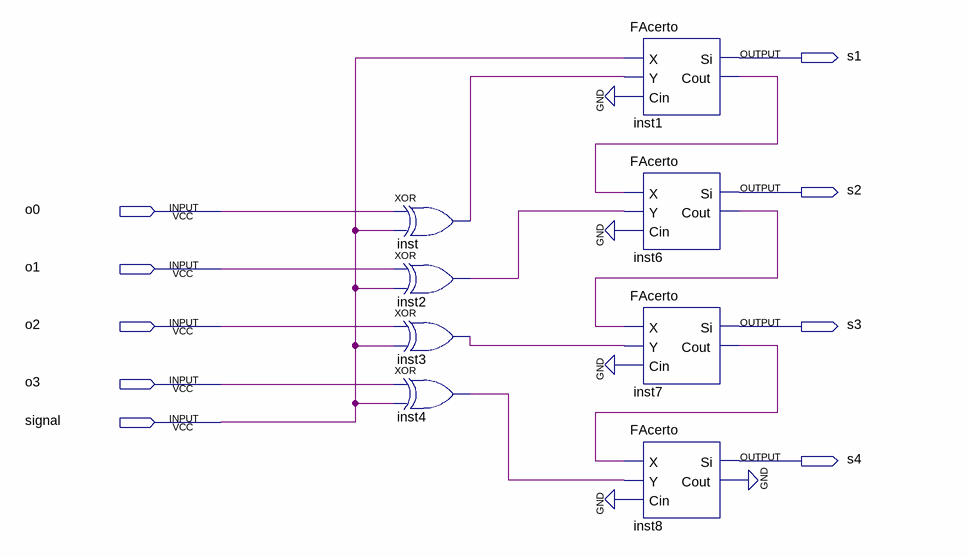
[diagram p0: schematic sheet]
// Quartus schematic comp2.bdf as structural Verilog: 8 symbols, 9 pins
module comp2 (
  input  o0,
  input  o1,
  input  o2,
  input  o3,
  input  signal,
  output s1,
  output s2,
  output s3,
  output s4
);

  wire inst1_cout, inst2_out, inst3_out, inst4_out, inst6_cout, inst7_cout, inst8_cout, inst_out;

  xor inst (inst_out, o0, signal);
  xor inst2 (inst2_out, o1, signal);
  xor inst3 (inst3_out, o2, signal);
  xor inst4 (inst4_out, o3, signal);
  FAcerto inst1 (.X(signal), .Y(inst_out), .Cin(1'b0), .Si(s1), .Cout(inst1_cout));
  FAcerto inst6 (.X(inst1_cout), .Y(inst2_out), .Cin(1'b0), .Si(s2), .Cout(inst6_cout));
  FAcerto inst7 (.X(inst6_cout), .Y(inst3_out), .Cin(1'b0), .Si(s3), .Cout(inst7_cout));
  FAcerto inst8 (.X(inst7_cout), .Y(inst4_out), .Cin(1'b0), .Si(s4), .Cout(inst8_cout));
  // also tied to GND on the sheet: inst8_cout
endmodule
